# Altium schematic sheet Netscale48HD_Microccontroller.SchDoc: STM32 Microcontroller
size A3; Organization: Reichle & De-Massari; Address1: Binzstrasse 32; Address2: 8620 Wetzikon; Address3: Switzerland; DocumentNumber: 5; Revision: V0.2; SheetNumber: 5; SheetTotal: 5
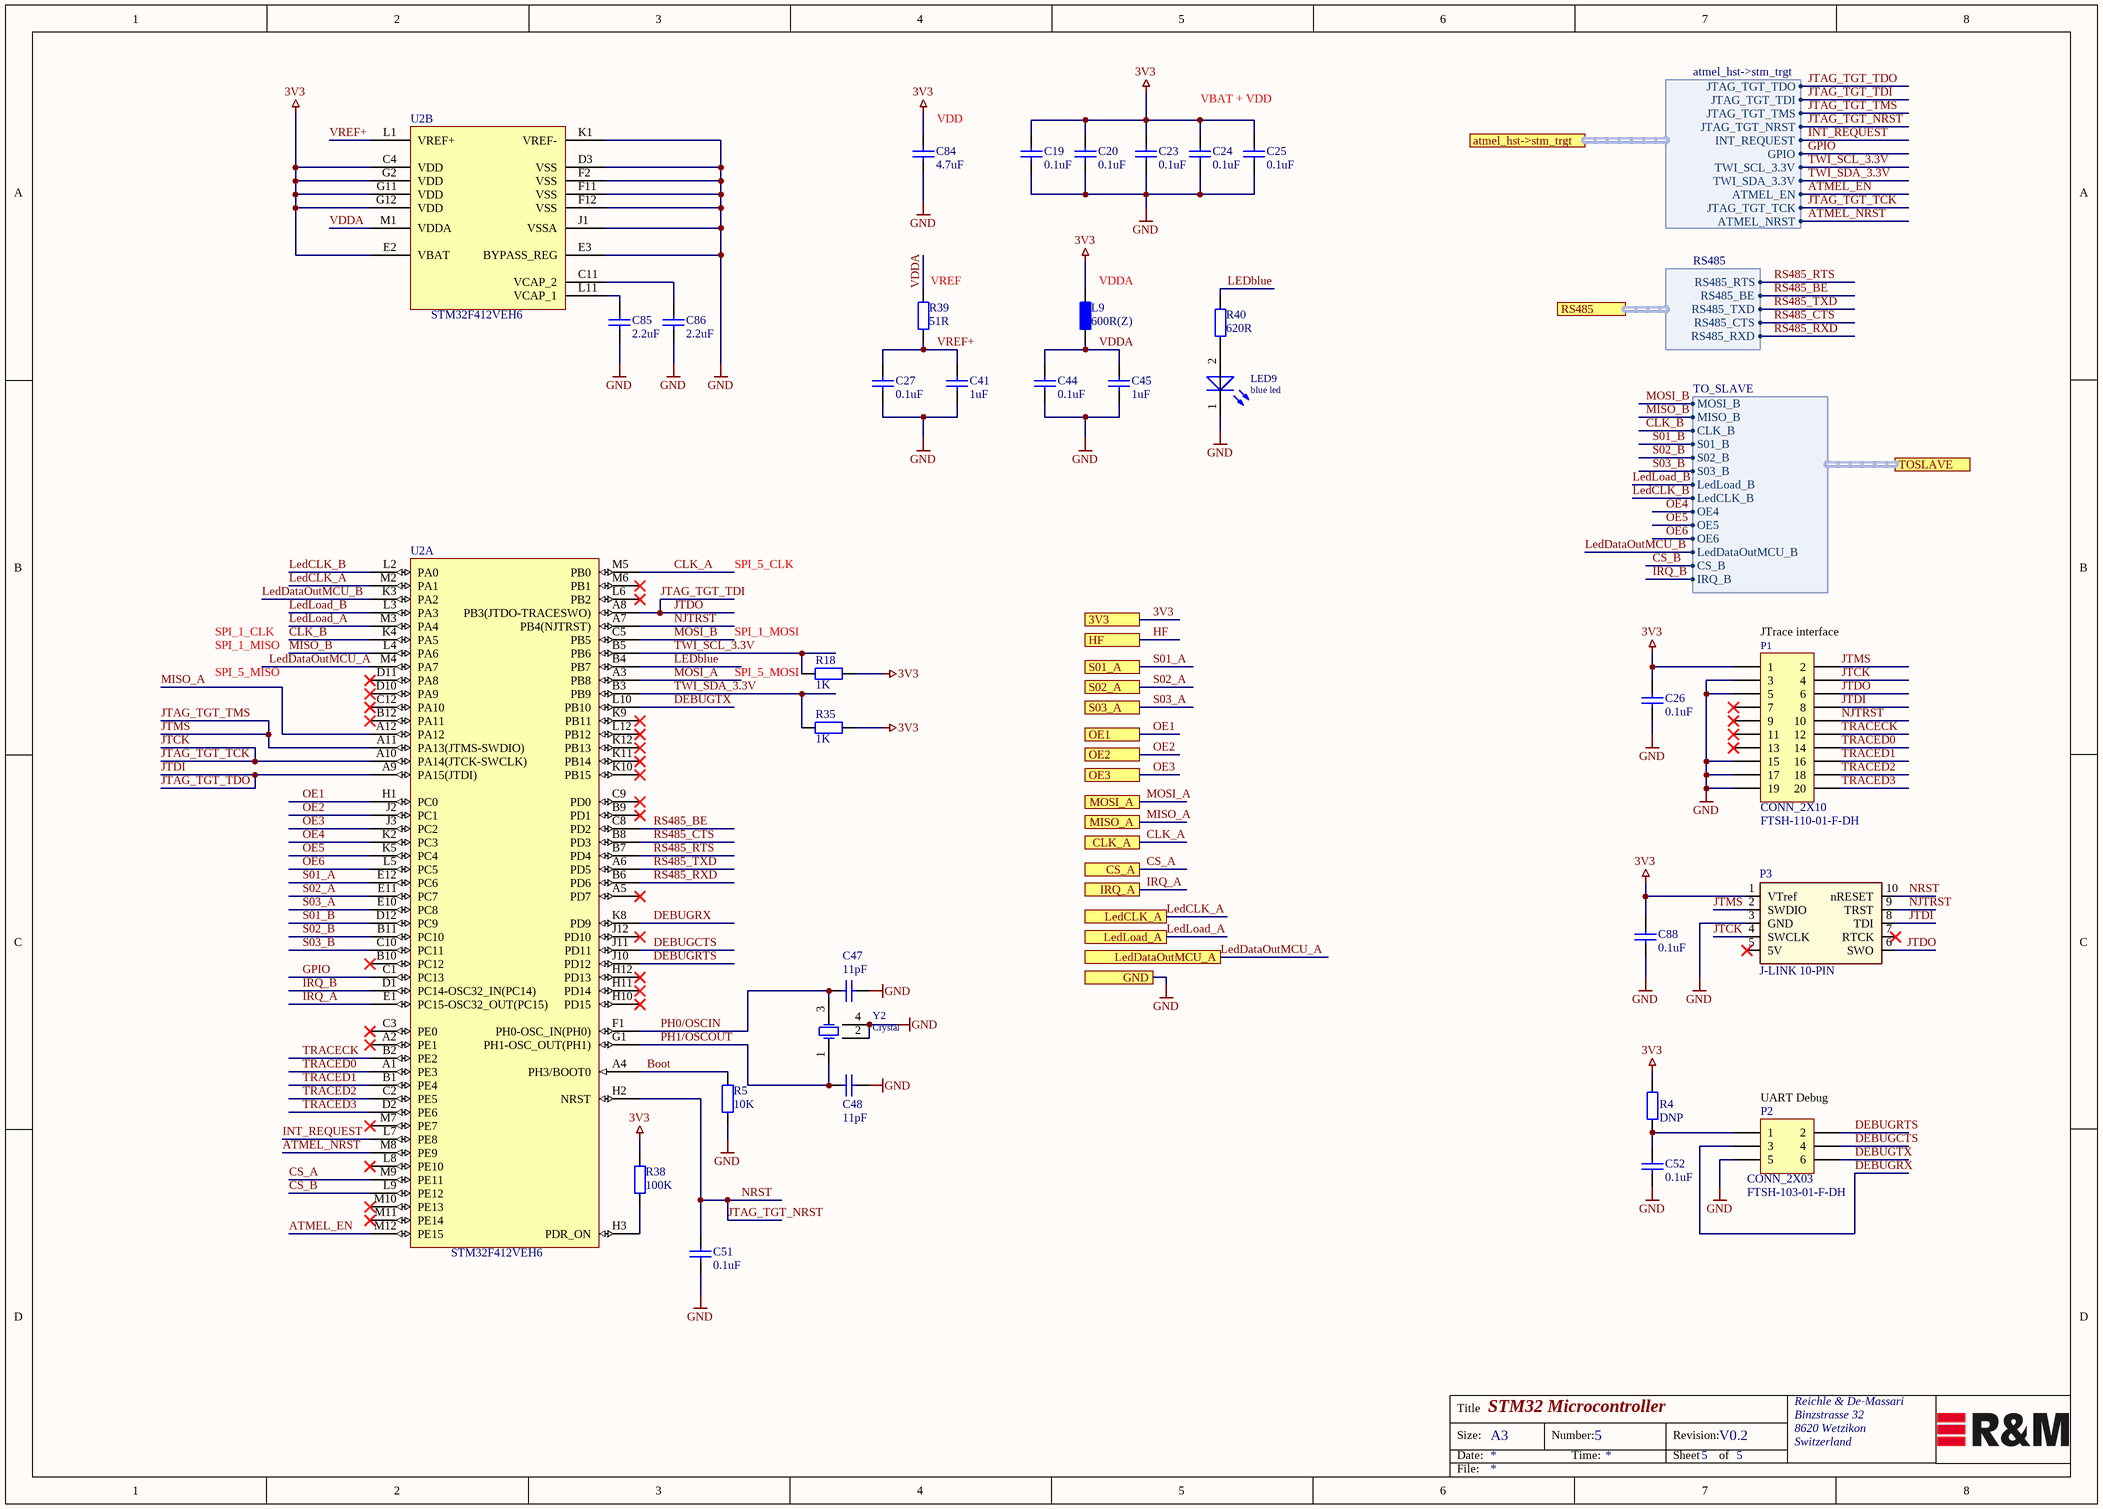
[diagram p0: Netscale48HD_Microccontroller.SchDoc]

## Parts
C19  0.1uF  [Ceramic Capacitor 0402 EIA]
C20  0.1uF  [Ceramic Capacitor 0402 EIA]
C23  0.1uF  [Ceramic Capacitor 0402 EIA]
C24  0.1uF  [Ceramic Capacitor 0402 EIA]
C25  0.1uF  [Ceramic Capacitor 0402 EIA]
C26  0.1uF  [CAPC1005X55N]
C27  0.1uF  [Ceramic Capacitor 0402 EIA]
C41  1uF  [Ceramic Capacitor 0402 EIA]
C44  0.1uF  [Ceramic Capacitor 0402 EIA]
C45  1uF  [Ceramic Capacitor 0402 EIA]
C47  11pF  [CAPC0402(1005)60_L]
C48  11pF  [CAPC0402(1005)60_L]
C51  0.1uF  [Ceramic Capacitor 0402 EIA]
C52  0.1uF  [Ceramic Capacitor 0402 EIA]
C84  4.7uF  [Ceramic Capacitor 0603 EIA]
C85  2.2uF  [Ceramic Capacitor 0402 EIA]
C86  2.2uF  [Ceramic Capacitor 0402 EIA]
C88  0.1uF  [Ceramic Capacitor 0402 EIA]
L9  600R(Z)  [Inductor 0603 EIA]
LED9  blue led  [Kingbright_SMD_2_RWH]
P1  CONN_2X10  [FTSH-110-01-F-DH]
P2  CONN_2X03  [FTSH-103-01-F-DH]
P3  J-LINK 10-PIN  [CONN-SEGGER-10-PIN]
R4  DNP  [RESC1005X40N]
R5  10K  [RES-0402[1005] - RFL]
R18  1K  [Resistor 0402 EIA]
R35  1K  [Resistor 0402 EIA]
R38  100K  [Resistor 0402 EIA]
R39  51R  [Resistor 0402 EIA]
R40  620R  [Resistor 0402 EIA]
U2  STM32F412VEH6  [STM_UFBGA100 7x7x0.6_100_R]  (parts A,B of 2)
Y2  Crystal  [ECS_ECX-2236_4_R]

## Ports
3V3, atmel_hst->stm_trgt (harness atmel_hst->stm_trgt), CLK_A, CS_A, GND, HF, IRQ_A, LedCLK_A, LedDataOutMCU_A, LedLoad_A, MISO_A, MOSI_A, OE1, OE2, OE3, RS485 (harness RS485), S01_A, S02_A, S03_A, TOSLAVE (harness TO_SLAVE)

## Harnesses
atmel_hst->stm_trgt: JTAG_TGT_TDO, JTAG_TGT_TDI, JTAG_TGT_TMS, JTAG_TGT_NRST, INT_REQUEST, GPIO, TWI_SCL_3.3V, TWI_SDA_3.3V, ATMEL_EN, JTAG_TGT_TCK, ATMEL_NRST
RS485: RS485_RXD, RS485_CTS, RS485_TXD, RS485_BE, RS485_RTS
TO_SLAVE: MOSI_B, MISO_B, CLK_B, S01_B, S02_B, S03_B, LedLoad_B, LedCLK_B, OE4, OE5, OE6, LedDataOutMCU_B, CS_B, IRQ_B

## Nets
3V3: C19.2 C20.2 C23.2 C24.2 C25.2 C26.2 C84.2 C88.2 L9.1 P1.1 P3.1(VTref) R4.2 R18.2 R35.2 R38.1 U2.C4(VDD) U2.E2(VBAT) U2.G2(VDD) U2.G11(VDD) U2.G12(VDD) ; port 3V3
GND: C19.1 C20.1 C23.1 C24.1 C25.1 C26.1 C27.1 C41.1 C44.1 C45.1 C47.2 C48.2 C51.1 C52.1 C84.1 C85.1 C86.1 C88.1 LED9.1(K) P1.3 P1.5 P1.15 P1.17 P1.19 P2.5 P3.3(GND) R5.2 U2.D3(VSS) U2.E3(BYPASS_REG) U2.F2(VSS) U2.F11(VSS) U2.F12(VSS) U2.J1(VSSA) U2.K1(VREF-) Y2.2(OSC2) Y2.4(OSC3) ; port GND
ATMEL_EN: U2.M12(PE15) ; port atmel_hst->stm_trgt.ATMEL_EN
ATMEL_NRST: U2.M8(PE9) ; port atmel_hst->stm_trgt.ATMEL_NRST
Boot: R5.1 U2.A4(PH3/BOOT0)
CLK_A: U2.M5(PB0) ; port CLK_A
CLK_B: U2.K4(PA5) ; port TOSLAVE.CLK_B
CS_A: U2.M9(PE11) ; port CS_A
CS_B: U2.L9(PE12) ; port TOSLAVE.CS_B
DEBUGCTS: P2.4 U2.J11(PD11)
DEBUGRTS: P2.2 U2.J10(PD12)
DEBUGRX: P2.3 U2.K8(PD9)
DEBUGTX: P2.6 U2.L10(PB10)
GPIO: U2.C1(PC13) ; port atmel_hst->stm_trgt.GPIO
HF: port HF
INT_REQUEST: U2.L7(PE8) ; port atmel_hst->stm_trgt.INT_REQUEST
IRQ_A: U2.E1(PC15-OSC32_OUT(PC15)) ; port IRQ_A
IRQ_B: U2.D1(PC14-OSC32_IN(PC14)) ; port TOSLAVE.IRQ_B
JTAG_TGT_NRST: C51.2 P3.10(nRESET) U2.H2(NRST) ; port atmel_hst->stm_trgt.JTAG_TGT_NRST  [also labelled NRST]
JTAG_TGT_TCK: P1.4 P3.4(SWCLK) U2.A10(PA14(JTCK-SWCLK)) ; port atmel_hst->stm_trgt.JTAG_TGT_TCK  [also labelled JTCK]
JTAG_TGT_TDI: P1.6 P3.6(SWO) U2.A8(PB3(JTDO-TRACESWO)) ; port atmel_hst->stm_trgt.JTAG_TGT_TDI  [also labelled JTDO]
JTAG_TGT_TDO: P1.8 P3.8(TDI) U2.A9(PA15(JTDI)) ; port atmel_hst->stm_trgt.JTAG_TGT_TDO  [also labelled JTDI]
JTAG_TGT_TMS: P1.2 P3.2(SWDIO) U2.A11(PA13(JTMS-SWDIO)) ; port atmel_hst->stm_trgt.JTAG_TGT_TMS  [also labelled JTMS]
LEDblue: R40.1 U2.B4(PB7)
LedCLK_A: U2.M2(PA1) ; port LedCLK_A
LedCLK_B: U2.L2(PA0) ; port TOSLAVE.LedCLK_B
LedDataOutMCU_A: U2.M4(PA7) ; port LedDataOutMCU_A
LedDataOutMCU_B: U2.K3(PA2) ; port TOSLAVE.LedDataOutMCU_B
LedLoad_A: U2.M3(PA4) ; port LedLoad_A
LedLoad_B: U2.L3(PA3) ; port TOSLAVE.LedLoad_B
MISO_A: U2.A12(PA12) ; port MISO_A
MISO_B: U2.L4(PA6) ; port TOSLAVE.MISO_B
MOSI_A: U2.A3(PB8) ; port MOSI_A
MOSI_B: U2.C5(PB5) ; port TOSLAVE.MOSI_B
NJTRST: P1.10 P3.9(TRST) U2.A7(PB4(NJTRST))
OE1: U2.H1(PC0) ; port OE1
OE2: U2.J2(PC1) ; port OE2
OE3: U2.J3(PC2) ; port OE3
OE4: U2.K2(PC3) ; port TOSLAVE.OE4
OE5: U2.K5(PC4) ; port TOSLAVE.OE5
OE6: U2.L5(PC5) ; port TOSLAVE.OE6
PH0/OSCIN: C47.1 U2.F1(PH0-OSC_IN(PH0)) Y2.3(OSC2)
PH1/OSCOUT: C48.1 U2.G1(PH1-OSC_OUT(PH1)) Y2.1(OSC1)
RS485_BE: U2.C8(PD2) ; port RS485.RS485_BE
RS485_CTS: U2.B8(PD3) ; port RS485.RS485_CTS
RS485_RTS: U2.B7(PD4) ; port RS485.RS485_RTS
RS485_RXD: U2.B6(PD6) ; port RS485.RS485_RXD
RS485_TXD: U2.A6(PD5) ; port RS485.RS485_TXD
S01_A: U2.E12(PC6) ; port S01_A
S01_B: U2.D12(PC9) ; port TOSLAVE.S01_B
S02_A: U2.E11(PC7) ; port S02_A
S02_B: U2.B11(PC10) ; port TOSLAVE.S02_B
S03_A: U2.E10(PC8) ; port S03_A
S03_B: U2.C10(PC11) ; port TOSLAVE.S03_B
TRACECK: P1.12 U2.B2(PE2)
TRACED0: P1.14 U2.A1(PE3)
TRACED1: P1.16 U2.B1(PE4)
TRACED2: P1.18 U2.C2(PE5)
TRACED3: P1.20 U2.D2(PE6)
TWI_SCL_3.3V: R18.1 U2.B5(PB6) ; port atmel_hst->stm_trgt.TWI_SCL_3.3V
TWI_SDA_3.3V: R35.1 U2.B3(PB9) ; port atmel_hst->stm_trgt.TWI_SDA_3.3V
VDDA: C44.2 C45.2 L9.2 R39.1 U2.M1(VDDA)
VREF+: C27.2 C41.2 R39.2 U2.L1(VREF+)
NetC52_2: C52.2 P2.1 R4.1
NetC85_2: C85.2 U2.L11(VCAP_1)
NetC86_2: C86.2 U2.C11(VCAP_2)
NetLED9_2: LED9.2(A) R40.2
NetR38_2: R38.2 U2.H3(PDR_ON)

Not connected (* = marked no-connect by the designer): P1 7* 9* 11* 13*; P3 5(5V)* 7(RTCK)*; U2 A2(PE1)* A5(PD7)* B9(PD1)* B10(PC12)* B12(PA11)* C3(PE0)* C9(PD0)* C12(PA10)* D10(PA9)* D11(PA8)* H10(PD15)* H11(PD14)* H12(PD13)* J12(PD10)* K9(PB11)* K10(PB15)* K11(PB14)* K12(PB13)* L6(PB2)* L8(PE10)* L12(PB12)* M6(PB1)* M7(PE7)* M10(PE13)* M11(PE14)*

## Notes on the sheet
- VBAT + VDD
- (near C84) VDD
- (near R39) VREF
- (near L9) VDDA
- SPI_5_CLK
- SPI_1_CLK
- SPI_1_MISO
- (near R18) SPI_1_MOSI
- (near P1) JTrace interface
- SPI_5_MISO
- (near R18) SPI_5_MOSI
- (near P2) UART Debug
- Title
- Size:
- Date:
- A3
- Number:
- Time:
- Revision:
- Sheet
- of
- File:

## Library data of the parts
C19 C20 C23-C25 C27 C44 C51 C88 = Cap_0.1uF_0402: SMD/SMT WCAP-CSGP 0.1uF 0402 20% 10V MLCC; Manufacturer: Wurth Electronics; Manufacturer PartNr: 885012105010; voltage: 10VDC; Replaceable: yes; Dielectric Grade: X5R; value: 0.1uF; tolerance: 20%; Footprint/Package: 0402; ComponentLink1Description: mouser; ComponentLink1URL: https://www.mouser.ch/ProductDetail/Wurth-Electronics/885012105010?qs=sGAEpiMZZMs0AnBnWHyRQEGbLOF2VP1ihL84oCjXnlO407YOHi%2fQbw%3d%3d; Supplier 1: Mouser; Supplier 2: Farnell; Supplier 3: Digi-Key; Supplier Part Number 1: 710-885012105010; Supplier Part Number 2: 2533928; Supplier Part Number 3: 732-7487-1-ND
C26 C52 = Cap_0.1uF_0402: SMD/SMT WCAP-CSGP 0.1uF 0402 20% 10V MLCC; Manufacturer: Wurth Electronics; Manufacturer PartNr: 885012105010; voltage: 10VDC; Dielectric Grade: X5R; Replaceable: yes; value: 0.1uF; tolerance: 20%; ComponentLink1Description: mouser; ComponentLink1URL: https://www.mouser.ch/ProductDetail/Wurth-Electronics/885012105010?qs=sGAEpiMZZMs0AnBnWHyRQEGbLOF2VP1ihL84oCjXnlO407YOHi%2fQbw%3d%3d; Footprint/Package: 0402; Supplier 1: Mouser; Supplier 2: Farnell; Supplier Part Number 1: 710-885012105010; Supplier Part Number 2: 2533928; Supplier 3: Digi-Key; Supplier Part Number 3: 732-7487-1-ND
C41 C45 = Cap_1uF_0402: SMD/SMT 0402 1uF 10volts X7S 10%; Manufacturer: Murata; Manufacturer PartNr: GCM155C71A105KE38D; voltage: 10VDC; Replaceable: yes; value: 1uF; tolerance: 10%; Footprint/Package: 0402 (1005 metric); Dielectric Grade: X7S; ComponentLink1Description: mouser; ComponentLink1URL: https://www.mouser.ch/ProductDetail/Murata-Electronics/GCM155C71A105KE38D?qs=sGAEpiMZZMsh%252b1woXyUXj0FEAttKcN54ouz5zO04smg%3d; Supplier Part Number 1: 490-13409-1-ND; Supplier 1: Digi-Key
C47 C48 = Cap_11pF_0402: SMD/SMT 0402 11pF 50volts C0G 5%; Manufacturer: Murata; Manufacturer PartNr: GRM1555C1H110JA01D; voltage: 50VDC; Dielectric Grade: C0G (NP0); Replaceable: yes; value: 11pF; tolerance: 5%; ComponentLink1Description: mouser; ComponentLink1URL: https://www.mouser.ch/ProductDetail/Murata-Electronics/GRM1555C1H110JA01D?qs=%2fha2pyFadug34NHqLs7eMMmZ4IY%2fB%2fBwtGmZmE%252bqlNJIuNiWKDU4cio3ILTIjZ7Z; Footprint/Package: 0402; Supplier 1: Mouser; Supplier 2: Digi-Key; Supplier 3: Farnell; Supplier Part Number 1: 81-GRM1555C1H110JA1D; Supplier Part Number 2: 490-5923-6-ND; Supplier Part Number 3: 2218837
C84 = Cap_4.7uF_0603: SMD/SMT 0603 4.7uF 10volts; Manufracturer: Murata; Manufacturer PartNr: GRM188R61A475KE15D; tolerance: 20%; voltage: 10VDC; Replaceable: yes; Dielectric Grade: X5R; value: 4.7uF; Footprint/Package: 0603
C85 C86 = Cap_2.2uF_0402: 2.2µF ±20% 25V Ceramic Capacitor X5R 0402 (1005 Metric); Manufacturer: Murata; Manufacturer PartNr: GRM155R61E225ME15D; Replaceable: yes; value: 2.2uF; tolerance: ±20%; voltage: 25V; Dielectric Grade: X5R; Footprint/Package: 0402; ComponentLink1Description: digikey; ComponentLink1URL: https://www.digikey.com/product-detail/en/murata-electronics-north-america/GRM155R61E225ME15D/490-10457-2-ND/5027542
L9 = Ind_600R_0603: Ferritperlen MULTILYR CHP BD 0603 600OHMS 25%; Manufacturer: Taiyo Yuden; Manufacturer PartNr: BK1608HS601-T; Replaceable: yes; current: 350mA; value: 600R(Z); tolerance: 25%; power: *; Footprint/Package: 0603; Supplier 1: Mouser; Supplier Part Number 1: 963-BK1608HS601-T
LED9 = APA1606VBC/D: blue, 1.6 x 0.6 mm Right Angle SMD Chip LED Lamp; Manufacturer: Kingbright; Replaceable: yes; Manufacturer PartNr: APA1606VBC/D; ComponentLink1Description: mouser; ComponentLink1URL: https://www.mouser.ch/ProductDetail/Kingbright/APA1606VBC-D?qs=%2fha2pyFaduhFkLoQLKawdk3E%252bl3FgSOr3Fif4NOc1lJmKkWDM5WlaQ%3d%3d; Footprint/Package: specific, see datasheet; Supplier 1: Digi-Key; Supplier Part Number 1: 754-2090-6-ND
P1 = CONN_2X10_FTSH-110-01-F-DH: 20Pin, 2Rows, side/horizontally, MICRO LOW-PROFILE TERMINAL STRIPS; Manufacturer: Samtec; Replaceable: no; Manufacturer PartNr: FTSH-110-01-F-DH; ComponentLink1Description: mouser; ComponentLink1URL: https://www.mouser.ch/ProductDetail/Samtec/FTSH-110-02-F-DH?qs=sGAEpiMZZMs%252bGHln7q6pm8Vn94ktop%2fJX5D4YaS%252bHqWex9Ov5NBeXw%3d%3d; Footprint/Package: 1.27 mm; Supplier 1: Digi-Key; Supplier 2: Farnell; Supplier 3: Mouser; Supplier Part Number 1: SAM11236-ND; Supplier Part Number 2: 2856415; Supplier Part Number 3: 200-FTS11002FDV
P2 = CONN_2X03_FTSH-103-01-F-DH: 6Pin, 2Rows, MICRO LOW-PROFILE TERMINAL STRIPS; Manufacturer: Samtec; Replaceable: no; Manufacturer PartNr: FTSH-103-01-F-DH; Footprint/Package: 1.27 mm
P3 = CONN_Segger_10_PIN: Segger, J-Link 10-pin Needle Adapter
R4 = Res_DNP_0402: Resistor: do not populate; Replaceable: no; value: DNP; tolerance: *; power: *; Manufacturer: do not populate; Manufacturer PartNr: do not populate; Footprint/Package: 0402
R5 = PassResBas0402-00623-A.3: 10K 0.063W 1% 0402 (1005 Metric)  SMD; Manufacturer: Yageo; Manufacturer PartNr: RC0402FR-0710KL; Replaceable: yes; value: 10K; tolerance: ±1%; Footprint/Package: 0402; Supplier 1: Digi-Key; Supplier Part Number 1: 311-10.0KLRCT-ND; Power: 0.063W
R18 R35 = Res_1K_0402: Thick Film Resistors - SMD CRGCQ 0402 1K0 1% SMD Resistor; Manufacturer: TE Connectivity; Manufacturer PartNr: CRGCQ0402F1K0; power: 1/16W; Replaceable: yes; value: 1K; tolerance: ±1%; Footprint/Package: 0402 (1005 metric); Supplier 1: Digi-Key; Supplier Part Number 1: A129627CT-ND; Supplier 2: Mouser; Supplier Part Number 2: 279-CRGCQ0402F1K0
R38 = Res_100K_0402: 100 kOhm Resistor 0402; Manufacturer: Vishay; Manufacturer PartNr: CRCW0402100KJNEDC; power: 63mW; Replaceable: yes; value: 100K; tolerance: -; Footprint/Package: 0402
R39 = Res_51R_0402: Resistor; Manufacturer: Yageo; Manufacturer PartNr: RC0402JR-0751RL; tolerance: 5%; power: 62.5mW; Replaceable: yes; value: 51R; Footprint/Package: 0402; ComponentLink1Description: mouser; ComponentLink1URL: https://www.mouser.ch/ProductDetail/Yageo/RC0402JR-0751RL?qs=sGAEpiMZZMtG0KNrPCHnjTtiZEI2zSDg2UFCMmEjZXQ%3d; Supplier 1: Farnell; Supplier 2: Mouser; Supplier 3: Digi-Key; Supplier Part Number 1: 1799298; Supplier Part Number 2: 603-RC0402JR-0751RL; Supplier Part Number 3: 311-51JRDKR-ND
R40 = Res_620R_0402: SMD 1/16W 620ohm 0.5%; Manufacturer: Susumu; Manufacturer PartNr: RR0510P-621-D; power: 62.5mW; Replaceable: yes; value: 620R; tolerance: 0.5%; Footprint/Package: 0402; ComponentLink1Description: mouser; ComponentLink1URL: https://www.mouser.ch/ProductDetail/Susumu/RR0510P-621-D?qs=sGAEpiMZZMu61qfTUdNhG%2fDhcyQpRg8MIBVoO7KVzPo%3d; Supplier 1: Mouser; Supplier 2: Digi-Key; Supplier Part Number 1: 754-RR0510P-621D; Supplier Part Number 2: RR05P620DDKR-ND
U2 = STM_STM32F412VEH6_UFBGA100 7x7x0.6_100: STM32 Dynamic Efficiency MCU with BAM, High-performance and DSP with FPU, ARM Cortex-M4 MCU with 512 Kbytes Flash, 100 MHz CPU, Art Accelerator, DFSDM; Manufacturer: STMicroelectronics; Replaceable: no; ComponentLink1Description: mouser; ComponentLink1URL: https://www.mouser.ch/ProductDetail/STMicroelectronics/STM32L431VCI6?qs=%2fha2pyFadugH5aS8CDb9Mm3u%252bAbg7zIVJiWcYxu1pWKDX51qWwrkAQ%3d%3d; Manufacturer PartNr: STM32F412VEH6; Footprint/Package: UFBGA-100; Supplier 1: Digi-Key; Supplier 2: Mouser; Supplier Part Number 1: STM32F412VEH6-ND; Supplier Part Number 2: 511-STM32F412VEH6
Y2 = ECS-240-10-36-CKL-TR: Quarz 24MHz-10pF 10ppm-10C +70C; Manufacturer: ECS; Replaceable: No; Load Capacitance: 10pF; Manufacturer Part Number: ECS-240-10-36-CKL-TR; Manufacturer PartNr: ECS-240-10-36-CKL-TR; Supplier 1: Mouser; Supplier Part Number 1: 520-240-10-36-CKLT; Footprint/Package: specific, see datasheet